# EAGLE design Tracker (EAGLE 8.3.1)
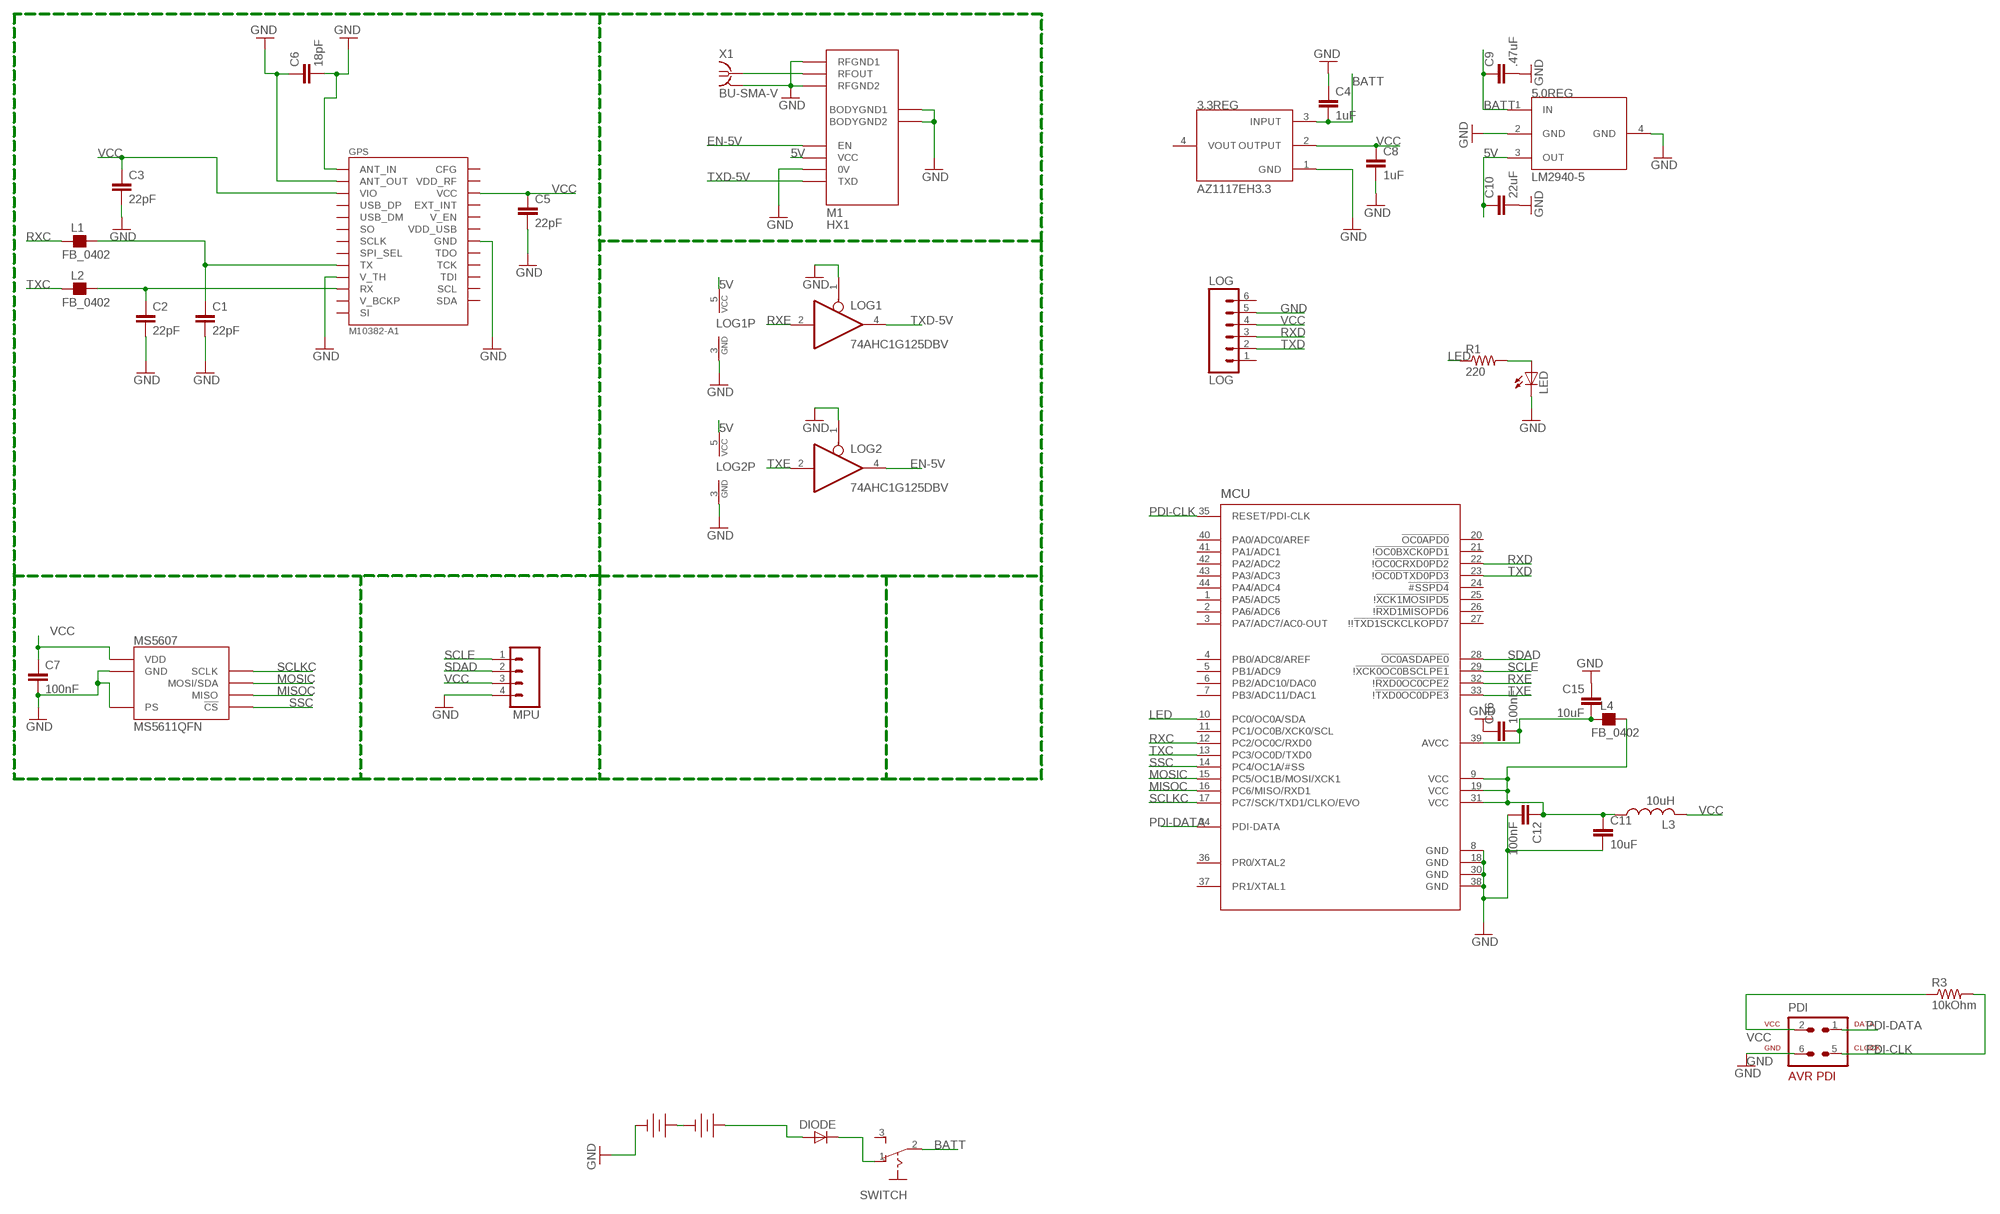
[diagram p0: schematic, sheet 1]

## Parts
3.3REG  AZ1117EH3.3  [SOT-223]
5.0REG  LM2940-5  [SOT-223]
BATT1  123_BATTERY_HOLDERCR-123-A  [CR-123-A_HOLDER]
BATT2  123_BATTERY_HOLDERCR-123-A  [CR-123-A_HOLDER]
C1  22pF  CAP0805  [0805]
C2  22pF  CAP0805  [0805]
C3  22pF  CAP0805  [0805]
C4  1uF  CAP0603-CAP  [0603-CAP]
C5  22pF  CAP0805  [0805]
C6  18pF  CAP0805  [0805]
C7  100nF  CAP0805  [0805]
C8  1uF  CAP0603-CAP  [0603-CAP]
C9  .47uF  CAP0603-CAP  [0603-CAP]
C10  22uF  CAP0603-CAP  [0603-CAP]
C11  10uF  CAP0805  [0805]
C12  100nF  CAP0805  [0805]
C15  10uF  CAP0805  [0805]
C16  100nF  CAP0805  [0805]
DIODE  LILYPAD-WEARABLES_LED1206  [LILYPAD-WEARABLES_LED-1206]
GPS  M10382-A1  [M10382-A1]
L1  FB_0402  [L0402]
L2  FB_0402  [L0402]
L3  10uH  L-USL2012C  [L2012C]
L4  FB_0402  [L0402]
LED  LEDCHIP-LED0603  [CHIP-LED0603]
LOG  LOG  SPARKFUN_M06SIP  [SPARKFUN_1X06]
LOG1  74AHC1G125DBV  [SOT23-5]
LOG2  74AHC1G125DBV  [SOT23-5]
M1  HX1  [HX1]
MCU  AT-XMEGA-XXA4-AU  [QFP80P1200X1200X120-44N]
MPU  M04  [04P]
MS5607  MS5611QFN  [MS5611-01BA01]
PDI  AVR-7_AVR-PDIVERT  [AVR-7_AVR-ISP-6]
R1  220  R-US_R0603  [R0603]
R3  10kOhm  RESISTOR0805-RES  [0805]
SWITCH  M251  [M251]
X1  BU-SMA-V  [BU-SMA-V]

## Nets
5V: 5.0REG.3(OUT) C10.1 LOG1.5(VCC) LOG2.5(VCC) M1.VCC
AVCC: C15.2 C16.2 L4.1 MCU.39(AVCC)
BATT: 3.3REG.3(INPUT) 5.0REG.1(IN) C4.2 C9.1 SWITCH.2(P)
EN-5V: LOG2.4(O) M1.EN
GND: 3.3REG.1(GND) 5.0REG.2(GND) 5.0REG.4(GND) BATT2.- C1.2 C2.2 C3.2 C4.1 C5.2 C6.1 C6.2 C7.2 C8.2 C9.2 C10.2 C11.2 C12.2 C15.1 C16.1 GPS.1(ANT_IN) GPS.2(GND) GPS.3(ANT_OUT) GPS.4(GND) GPS.12(V_TH) GPS.14(GND) GPS.17(GND) GPS.21(GND) GPS.24(GND) GPS.26(GND) GPS.28(GND) GPS.33(GND) GPS.34(GND) GPS.35(GND) GPS.36(GND) LED.C LOG1.1(OE) LOG1.3(GND) LOG2.1(OE) LOG2.3(GND) LOG.5 M1.0V M1.BODYGND1 M1.BODYGND2 M1.RFGND1 M1.RFGND2 MCU.8(GND) MCU.18(GND) MCU.30(GND) MCU.38(GND) MPU.4 MS5607.2(PS) MS5607.3(GND) PDI.6 X1.2(GND)
LED: MCU.10(PC0/OC0A/SDA) R1.1
MISOC: MCU.16(PC6/MISO/RXD1) MS5607.6(MISO)
MOSIC: MCU.15(PC5/OC1B/MOSI/XCK1) MS5607.7(MOSI/SDA)
N$1: C1.1 GPS.11(TX) L1.2
N$2: C2.1 GPS.13(RX) L2.2
N$4: BATT1.- BATT2.+
N$5: M1.RFOUT X1.1
N$6: BATT1.+ DIODE.A
N$7: DIODE.C SWITCH.1(O)
N$10: LED.A R1.2
N$18: C11.1 C12.1 L3.1 L4.2 MCU.9(VCC) MCU.19(VCC) MCU.31(VCC)
PDI-CLK: MCU.35(RESET/PDI-CLK) PDI.5 R3.2
PDI-DATA: MCU.34(PDI-DATA) PDI.1
RXC: L1.1 MCU.12(PC2/OC0C/RXD0)
RXD: LOG.3 MCU.22(!!OC0CRXD0PD2)
RXE: LOG1.2(I) MCU.32(!!RXD0OC0CPE2)
SCLE: MCU.29(!!XCK0OC0BSCLPE1) MPU.1
SCLKC: MCU.17(PC7/SCK/TXD1/CLKO/EVO) MS5607.8(SCLK)
SDAD: MCU.28(!OC0ASDAPE0) MPU.2
SSC: MCU.14(PC4/OC1A/#SS) MS5607.4(!CS!) MS5607.5(!CS!)
TXC: L2.1 MCU.13(PC3/OC0D/TXD0)
TXD: LOG.2 MCU.23(!!OC0DTXD0PD3)
TXD-5V: LOG1.4(O) M1.TXD
TXE: LOG2.2(I) MCU.33(!!TXD0OC0DPE3)
VCC: 3.3REG.2(OUTPUT) C3.1 C5.1 C7.1 C8.1 GPS.5(VIO) GPS.27(VCC) L3.2 LOG.4 MPU.3 MS5607.1(VDD) PDI.2 R3.1
Unconnected: 3.3REG.4(VOUT) GPS.6(USB_DP) GPS.7(USB_DM) GPS.8(SO) GPS.9(SCLK) GPS.10(SPI_SEL) GPS.15(V_BCKP) GPS.16(SI) GPS.18(SDA) GPS.19(SCL) GPS.20(TDI) GPS.22(TCK) GPS.23(TDO) GPS.25(VDD_RF) GPS.29(EXT_INT) GPS.30(V_EN) GPS.31(CFG) GPS.32(VDD_USB) LOG.1 LOG.6 MCU.1(PA5/ADC5) MCU.2(PA6/ADC6) MCU.3(PA7/ADC7/AC0-OUT) MCU.4(PB0/ADC8/AREF) MCU.5(PB1/ADC9) MCU.6(PB2/ADC10/DAC0) MCU.7(PB3/ADC11/DAC1) MCU.11(PC1/OC0B/XCK0/SCL) MCU.20(!OC0APD0) MCU.21(!!OC0BXCK0PD1) MCU.24(!#SSPD4) MCU.25(!!XCK1MOSIPD5) MCU.26(!!RXD1MISOPD6) MCU.27(!!!TXD1SCKCLKOPD7) MCU.36(PR0/XTAL2) MCU.37(PR1/XTAL1) MCU.40(PA0/ADC0/AREF) MCU.41(PA1/ADC1) MCU.42(PA2/ADC2) MCU.43(PA3/ADC3) MCU.44(PA4/ADC4) SWITCH.3(S)

## Power pins joined to a net without a drawn wire
GND: X1.3(GND) X1.4(GND) X1.5(GND)

## Library data of the parts
3.3REG = Physoon:AZ1117EH
5.0REG = Physoon:LM2940
BATT1 BATT2 = SHC:123_BATTERY_HOLDER
C1-C12 C15 C16 = SparkFun:CAP: Capacitor Standard 0603 ceramic capacitor, and 0.1" leaded capacitor.
DIODE = Physoon:LILYPAD-WEARABLES_LED: LEDs Standard schematic elements and footprints for 5mm, 3mm, 1206, and 0603 sized LEDs. 5mm - Spark Fun Electronics SKU : Comp-SBL
GPS = SHC:M10382-A1: Antenova’s GPS RADIONOVA® M10382 is a single package solution that combines a full GPS engine and antenna on a small SMD module. The M10382 is a highly integrated GPS RF Antenna Module suitable for L1-band GPS and A-GPS systems. The device combines the high performance u-blox 6 GPS position engine with Antenova’s high efficiency antenna technology in a small SMD module. M10382 also benefits from novel external matching that ensures easy tuning for each platform. All front-end and receiver components are contained in a single package laminate base module, providing a complete GPS receiver for optimum performance. The M10382 operates on 1.8V or 3.3V positive supply with low power consumption and several low power modes for further power savings. An accurate 0.5ppm TCXO and very low noise LNA ensures high sensitivity and short TTFF. The M10382 is supported by u-blox stand alone software and is compatible with UART, SPI, DDC, I2C and USB host processor interfaces.
L1 L2 L4 = rc-master-smd:FB_: FERRITE BEAD
L3 = rcl:L-US: INDUCTOR, American symbol
LED = led:LED: LED OSRAM: - CHIPLED LG R971, LG N971, LY N971, LG Q971, LY Q971, LO R971, LY R971 LH N974, LH R974 LS Q976, LO Q976, LY Q976 LO Q996 - Hyper CHIPLED LW Q18S LB Q993, LB Q99A, LB R99A - SideLED LS A670, LO A670, LY A670, LG A670, LP A670 LB A673, LV A673, LT A673, LW A673 LH A674 LY A675 LS A676, LA A676, LO A676, LY A676, LW A676 LS A679, LY A679, LG A679 - Hyper Micro SIDELED® LS Y876, LA Y876, LO Y876, LY Y876 LT Y87S - SmartLED LW L88C, LW L88S LB L89C, LB L89S, LG L890 LS L89K, LO L89K, LY L89K LS L896, LA L896, LO L896, LY L896 - TOPLED LS T670, LO T670, LY T670, LG T670, LP T670 LSG T670, LSP T670, LSY T670, LOP T670, LYG T670 LG T671, LOG T671, LSG T671 LB T673, LV T673, LT T673, LW T673 LH T674 LS T676, LA T676, LO T676, LY T676, LB T676, LH T676, LSB T676, LW T676 LB T67C, LV T67C, LT T67C, LS T67K, LO T67K, LY T67K, LW E67C LS E67B, LA E67B, LO E67B, LY E67B, LB E67C, LV E67C, LT E67C LW T67C LS T679, LY T679, LG T679 LS T770, LO T770, LY T770, LG T770, LP T770 LB T773, LV T773, LT T773, LW T773 LH T774 LS E675, LA E675, LY E675, LS T675 LS T776, LA T776, LO T776, LY T776, LB T776 LHGB T686 LT T68C, LB T68C - Hyper Mini TOPLED® LB M676 - Mini TOPLED Santana® LG M470 LS M47K, LO M47K, LY M47K Source: http://www.osram.convergy.de LUXEON: - LUMILED® LXK2-PW12-R00, LXK2-PW12-S00, LXK2-PW14-U00, LXK2-PW14-V00 LXK2-PM12-R00, LXK2-PM12-S00, LXK2-PM14-U00 LXK2-PE12-Q00, LXK2-PE12-R00, LXK2-PE12-S00, LXK2-PE14-T00, LXK2-PE14-U00 LXK2-PB12-K00, LXK2-PB12-L00, LXK2-PB12-M00, LXK2-PB14-N00, LXK2-PB14-P00, LXK2-PB14-Q00 LXK2-PR12-L00, LXK2-PR12-M00, LXK2-PR14-Q00, LXK2-PR14-R00 LXK2-PD12-Q00, LXK2-PD12-R00, LXK2-PD12-S00 LXK2-PH12-R00, LXK2-PH12-S00 LXK2-PL12-P00, LXK2-PL12-Q00, LXK2-PL12-R00 Source: www.luxeon.com KINGBRIGHT: KA-3528ASYC Source: www.kingbright.com
LOG = Tracker:SPARKFUN_M06: Header 6 Standard 6-pin 0.1" header. Use with straight break away headers (SKU : PRT-00116), right angle break away headers (PRT-00553), swiss pins (PRT-00743), machine pins (PRT-00117), and female headers (PRT-00115). Molex polarized connector foot print use with SKU : PRT-08094 with associated crimp pins and housings. NOTES ON THE VARIANTS LOCK and LOCK_LONGPADS... This footprint was designed to help hold the alignment of a through-hole component (i.e. 6-pin header) while soldering it into place. You may notice that each hole has been shifted either up or down by 0.005 of an inch from it's more standard position (which is a perfectly straight line). This slight alteration caused the pins (the squares in the middle) to touch the edges of the holes. Because they are alternating, it causes a "brace" to hold the component in place. 0.005 has proven to be the perfect amount of "off-center" position when using our standard breakaway headers. Although looks a little odd when you look at the bare footprint, once you have a header in there, the alteration is very hard to notice. Also, if you push a header all the way into place, it is covered up entirely on the bottom side. This idea of altering the position of holes to aid alignment will be further integrated into the Sparkfun Library for other footprints. It can help hold any component with 3 or more connection pins.
LOG1 LOG2 = 74xx-little-us:74*1G125: Single Bus Buffer Gate with 3-State Output
M1 = trackuino:HX1
MCU = xmega-a4:AT-XMEGA-XXA4-AU: ATxMega a4 Serie
MPU = con-amp-quick:M04: AMP QUICK CONNECTOR; OC_FARNELL: unknown; OC_NEWARK: unknown
MS5607 = SHC:MS5611
PDI = Tracker:AVR-7_AVR-PDI: AVR PDI programming interface connector
R1 = resistor:R-US_: RESISTOR, American symbol
R3 = SparkFun:RESISTOR: Resistor Basic schematic elements and footprints for 0603, 1206, and PTH resistors.
SWITCH = switch:M251: SLIDING SWITCH Mors, distributor Buerklin, 11G702
X1 = con-coax:BU-SMA-V: FEMALE SMA CONNECTOR Radiall distributor RS 112-3794; OC_FARNELL: unknown; OC_NEWARK: unknown

## Board
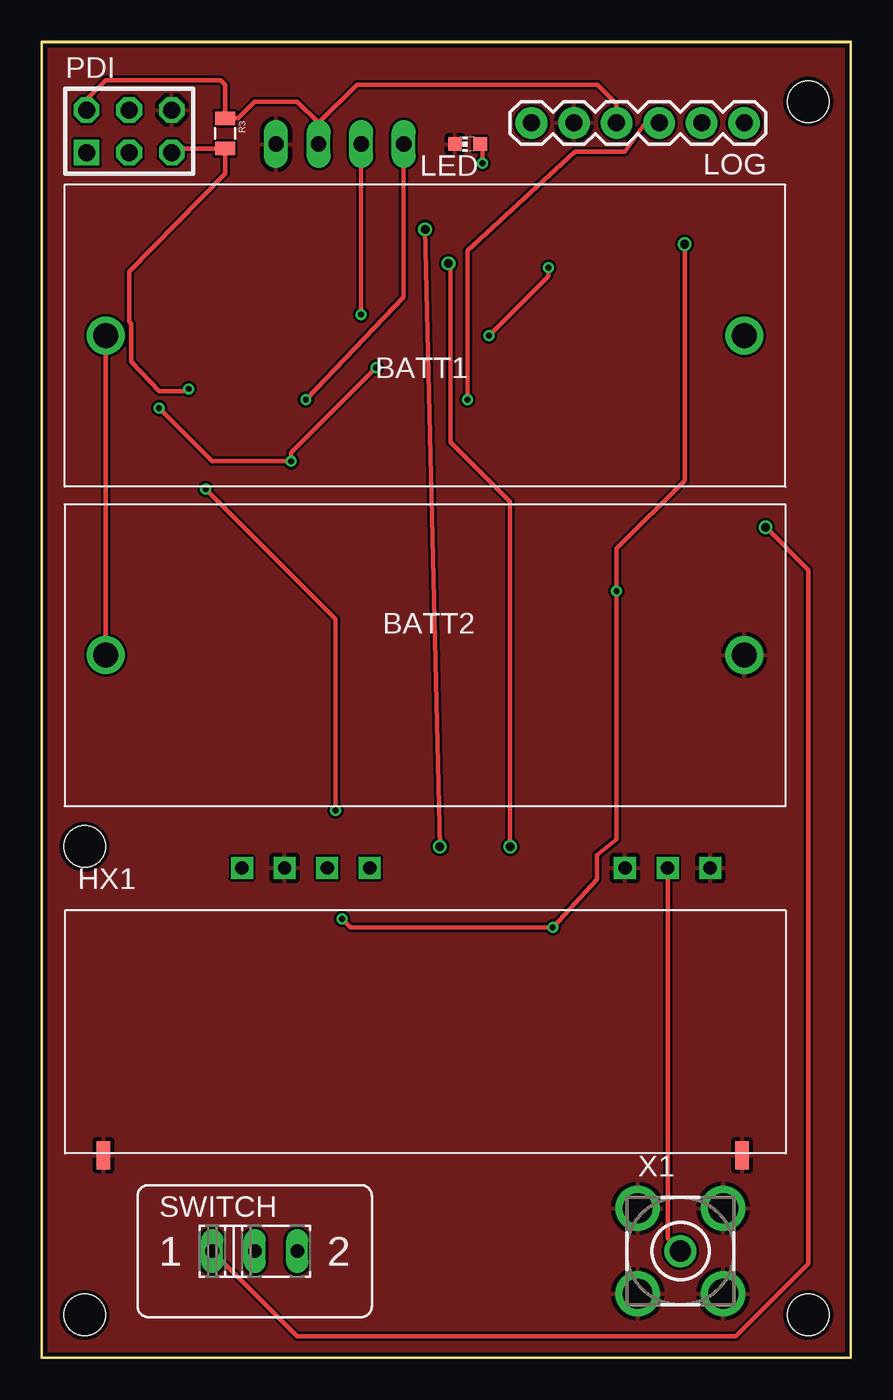
[diagram p1: board, top side]
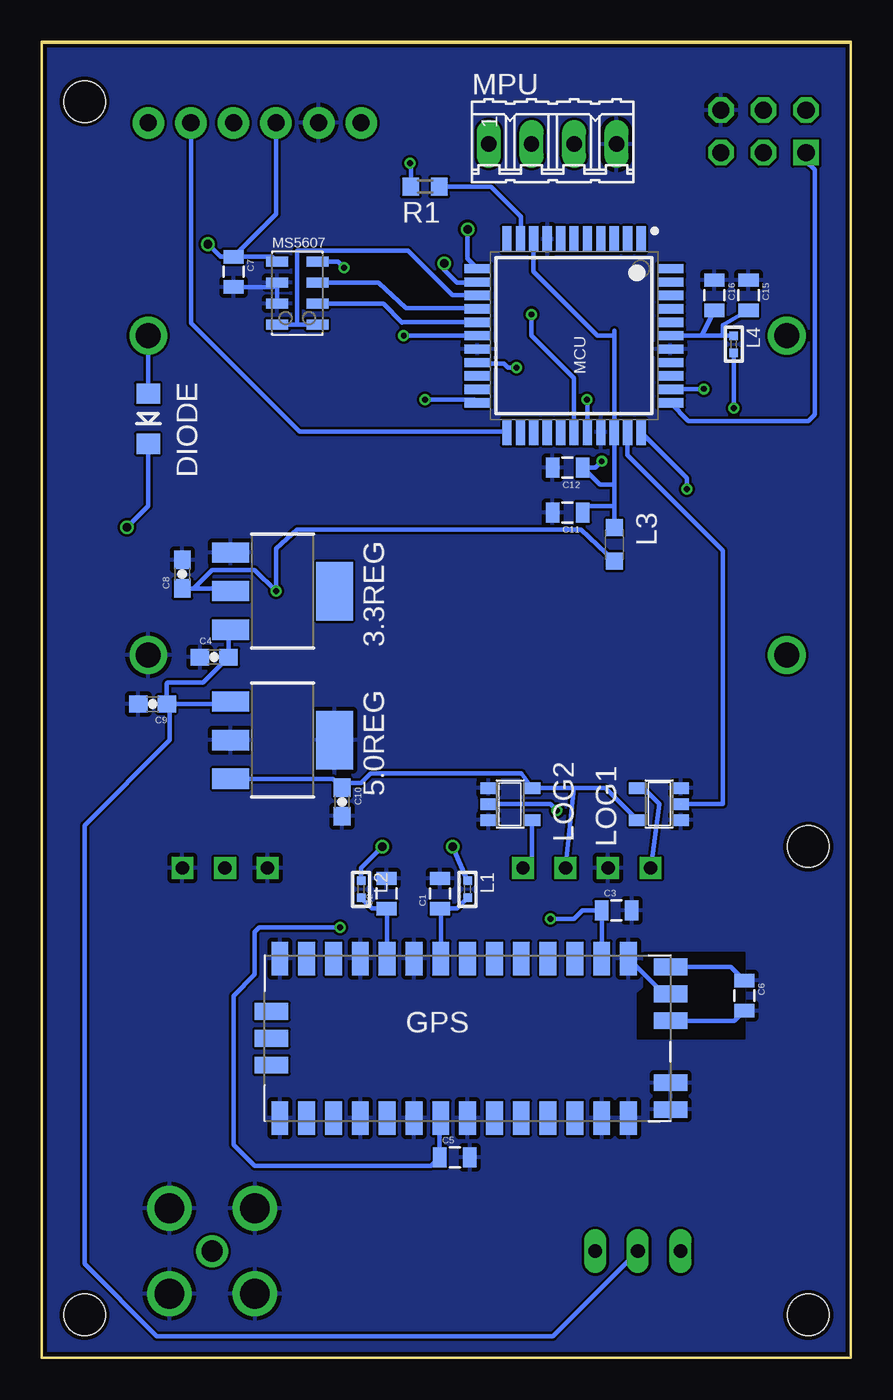
[diagram p2: board, bottom side, seen from below]

Size 48.26 x 78.49 mm. Coordinates in mm from the lower left corner, seen from the top.
Outline: 48.24,0 48.24,78.41 0,78.41 0,0
Outline: 0,0 48.24,0
Outline: 48.24,0 48.26,0 48.26,78.49 0,78.49 0,0
Copper layers (1*16): Top 0.035mm / dielectric 1.5mm / Bottom 0.035mm
Design rules "SeeedStudio_2layer_DRU_no_angle_20140221": minimum track width 6mil, minimum drill 12mil, track to track 6mil, track to pad 6mil, pad to pad 6mil, via to via 6mil, smd to smd 0mil, copper to edge 10mil, drill to drill 10mil, minimum pad ring 10mil, minimum via ring 6mil, stop-mask expansion 2mil, vias tented up to drill 100mil, thermal gap 10mil
Holes 2.46 mm at 2.54,2.54 2.54,30.48 45.72,74.93 45.72,2.54

### Footprints (pad centres in the part's own frame; a part is rotated, then mirrored left to right if it is on the bottom)
SOT-223 = smd 1.2 x 2.2: 1 -2.3,1.1; 2 0,1.1; 3 2.3,1.1 | smd 3.5 x 2.2: 4 0,7.3
CR-123-A_HOLDER = drill 1.5: + -19.05,0; - 19.05,0
0805 = smd 0.8 x 1.2: 1 -0.9,0; 2 0.9,0
0603-CAP = smd 1.1 x 1: 1 -0.85,0; 2 0.85,0
LILYPAD-WEARABLES_LED-1206 = smd 1.2 x 1.4: A -1.5,0; C 1.5,0
M10382-A1 = smd 1 x 2: 1 -1.05,12.1; 2 -2.65,12.1; 3 -4.25,12.1; 18 -1.6,-11.7; 19 0,-11.7; 20 1.6,-11.7; 35 4.25,12.1; 36 2.65,12.1 | smd 2 x 1: 4 -4.75,9.6; 5 -4.75,8; 6 -4.75,6.4; 7 -4.75,4.8; 8 -4.75,3.2; 9 -4.75,1.6; 10 -4.75,0; 11 -4.75,-1.6; 12 -4.75,-3.2; 13 -4.75,-4.8; 14 -4.75,-6.4; 15 -4.75,-8; 16 -4.75,-9.6; 17 -4.75,-11.2; 21 4.75,-11.2; 22 4.75,-9.6; 23 4.75,-8; 24 4.75,-6.4; 25 4.75,-4.8; 26 4.75,-3.2; 27 4.75,-1.6; 28 4.75,0; 29 4.75,1.6; 30 4.75,3.2; 31 4.75,4.8; 32 4.75,6.4; 33 4.75,8; 34 4.75,9.6
L0402 = smd 0.5 x 0.5: 1 -0.508,0; 2 0.508,0
L2012C = smd 1 x 1: 1 -1,0; 2 1,0
CHIP-LED0603 = smd 0.8 x 0.8: A 0,-0.75; C 0,0.75
SPARKFUN_1X06 = drill 1.016 pad 1.88: 1 0,0; 2 2.54,0; 3 5.08,0; 4 7.62,0; 5 10.16,0; 6 12.7,0
SOT23-5 = smd 0.69 x 0.99: 1 -0.95,-1.29; 2 0,-1.29; 3 0.95,-1.29; 4 0.95,1.3; 5 -0.95,1.3
HX1 = drill 0.8 square: 0V 25.4,-8.89; EN 20.32,-8.89; RFGND1 0,-8.89; RFGND2 5.08,-8.89; RFOUT 2.54,-8.89; TXD 27.94,-8.89; VCC 22.86,-8.89 | smd 0.813 x 1.676: BODYGND1 -1.905,8.255; BODYGND2 36.195,8.255
QFP80P1200X1200X120-44N = smd 1.55 x 0.55: 1 -5.75,4; 2 -5.75,3.2; 3 -5.75,2.4; 4 -5.75,1.6; 5 -5.75,0.8; 6 -5.75,0; 7 -5.75,-0.8; 8 -5.75,-1.6; 9 -5.75,-2.4; 10 -5.75,-3.2; 11 -5.75,-4; 23 5.75,-4; 24 5.75,-3.2; 25 5.75,-2.4; 26 5.75,-1.6; 27 5.75,-0.8; 28 5.75,0; 29 5.75,0.8; 30 5.75,1.6; 31 5.75,2.4; 32 5.75,3.2; 33 5.75,4 | smd 0.55 x 1.55: 12 -4,-5.75; 13 -3.2,-5.75; 14 -2.4,-5.75; 15 -1.6,-5.75; 16 -0.8,-5.75; 17 0,-5.75; 18 0.8,-5.75; 19 1.6,-5.75; 20 2.4,-5.75; 21 3.2,-5.75; 22 4,-5.75; 34 4,5.75; 35 3.2,5.75; 36 2.4,5.75; 37 1.6,5.75; 38 0.8,5.75; 39 0,5.75; 40 -0.8,5.75; 41 -1.6,5.75; 42 -2.4,5.75; 43 -3.2,5.75; 44 -4,5.75
04P = drill 0.914 long: 1 -3.81,0; 2 -1.27,0; 3 1.27,0; 4 3.81,0
MS5611-01BA01 = smd 1.3 x 0.6: 1 -1.2,1.875; 2 -1.2,0.625; 3 -1.2,-0.625; 4 -1.2,-1.875; 5 1.2,-1.875; 6 1.2,-0.625; 7 1.2,0.625; 8 1.2,1.875
AVR-7_AVR-ISP-6 = drill 1.016 square: 1 -2.54,-1.27 | drill 1.016 octagon: 2 -2.54,1.27; 3 0,-1.27; 4 0,1.27; 5 2.54,-1.27; 6 2.54,1.27
R0603 = smd 1 x 1.1: 1 -0.85,0; 2 0.85,0
M251 = drill 0.813 long: 1 -2.54,0; 2 0,0; 3 2.54,0
BU-SMA-V = drill 1.27: 1 0,0 | drill 1.778: 2 -2.55,2.55; 3 2.55,2.55; 4 2.55,-2.55; 5 -2.55,-2.55

### Placement (x,y rotation side)
3.3REG  38.1,45.72 270 bottom
5.0REG  38.1,36.83 270 bottom
BATT1  22.86,60.96 180 top
BATT2  22.86,41.91 0 top
C1  24.51,27.69 90 bottom
C2  27.69,27.69 90 bottom
C3  13.97,26.67 0 bottom
C4  37.97,41.78 0 bottom
C5  23.62,11.94 0 bottom
C6  6.35,21.59 270 bottom
C7  36.83,64.77 270 bottom
C8  39.88,46.74 90 bottom
C9  41.66,38.99 180 bottom
C10  30.35,33.15 270 bottom
C11  16.89,50.42 180 bottom
C12  16.89,53.09 180 bottom
C15  6.1,63.37 270 bottom
C16  8.13,63.37 270 bottom
DIODE  41.91,56.01 270 bottom
GPS  22.86,19.05 270 bottom
L1  22.86,27.94 270 bottom
L2  29.21,27.94 270 bottom
L3  14.1,48.51 270 bottom
L4  6.99,60.45 270 bottom
LED  25.4,72.39 90 top
LOG  41.91,73.66 180 top
LOG1  11.43,33.02 90 bottom
LOG2  20.32,33.02 270 bottom
M1  39.88,20.32 180 top
MCU  16.51,60.96 270 bottom
MPU  17.78,72.39 0 bottom
MS5607  33.02,63.5 0 bottom
PDI  5.21,73.15 0 top
R1  25.4,69.85 180 bottom
R3  10.92,73.03 270 top
SWITCH  12.7,6.35 0 top
X1  38.1,6.35 0 top

### Tracks (layer width: path | path; a pad name or v marks a point on that pad's centre or on a via)
5V
  Bottom 0.254: 16.51,33.97 LOG2.5 19.64,34.85 21.59,34.85 22.22,34.85 28.65,34.85 29.21,34.29 30.06,34.29 C10.1 30.89,34.53 5.0REG.3 | 16.51,33.97 14.63,33.97 LOG1.5 | 16.51,33.97 M1.VCC
AVCC
  Bottom 0.254: L4.1 7.62,60.96 | 7.62,60.96 8.89,60.96 | 8.89,60.96 MCU.39 | 8.89,60.96 C16.2 | 7.62,60.96 7.62,61.59 C15.2
BATT
  Bottom 0.254: C4.2 37,41.66 | C4.2 37.12,43.3 3.3REG.3 | C4.2 38.65,40.26 40.77,40.26 40.81,40.22 C9.1 | C9.1 40.64,38.82 40.64,36.83 45.72,31.75 45.72,5.59 41.4,1.27 17.78,1.27 SWITCH.2 | C9.1 37.14,38.99 5.0REG.1
EN-5V
  Bottom 0.254: LOG2.4 19.02,29.24 M1.EN
GND
  Bottom 0.254: C7.2 34.48,63.87 MS5607.2 MS5607.3 | GPS.3 7.16,23.3 C6.1 | GPS.1 6.94,20.1 C6.2 | GPS.2 11.16,21.7 GPS.4
  pour Bottom: 0,0 48.26,0 48.26,78.36 0,78.36
  pour Top: 0,0 48.26,0 48.26,78.36 0,78.36
LED
  Bottom 0.254: R1.1 22.86,69.85 | 22.86,69.85 22.2,69.85 | 22.86,69.85 21.46,69.85 19.68,68.07 19.68,66.73 MCU.10
MISOC
  Bottom 0.254: MS5607.6 27.89,62.88 26.77,61.75 26.76,61.76 MCU.16
MOSIC
  Bottom 0.254: MS5607.7 28.18,64.12 26.54,62.61 22.31,62.61 MCU.15
N$1
  Bottom 0.254: GPS.11 24.46,26.73 C1.1 23.51,26.79 L1.2
N$2
  Bottom 0.254: GPS.13 27.66,26.76 C2.1 28.56,26.79 L2.2
N$4
  Top 0.254: BATT2.+ BATT1.-
N$5
  Top 0.254: M1.RFOUT 37.34,7.11 X1.1
N$6
  Bottom 0.254: BATT1.+ DIODE.A
N$7  (via drill 0.51)
  Top 0.254: v43.18,49.53 45.72,46.99 45.72,5.59 41.4,1.27 15.24,1.27 SWITCH.1
  Bottom 0.254: DIODE.C 41.91,50.8 v43.18,49.53
N$8
  cutout Bottom: 6.35,24.13 6.35,19.05 12.7,19.05 12.7,21.72 12.32,22.1 12.32,24.13
N$10  (via drill 0.35)
  Top 0.254: v26.29,71.25 26.29,72.25 LED.A
  Bottom 0.254: R1.2 26.25,71.21 v26.29,71.25
N$18  (via drill 0.35)
  Top 0.254: v6.99,56.64 10.16,53.47 v14.86,53.47 14.86,53.97 v19.94,59.06
  Bottom 0.254: L3.1 14.1,50.8 | 14.1,50.8 14.1,52.07 | 14.1,52.07 14.1,55.2 MCU.31 14.11,60.96 | 14.1,50.8 15.61,50.8 C11.1 | 14.1,52.07 14.97,52.07 C12.1 15.24,53.09 v14.86,53.47 | v6.99,56.64 L4.2 | 14.11,60.96 14.11,61.27 | v19.94,59.06 20.45,59.06 20.7,59.31 22.21,59.31 MCU.19 | 14.11,60.96 15.11,60.96 18.92,64.77 18.92,66.7 MCU.9
PDI-CLK  (via drill 0.35)
  Top 0.254: PDI.5 7.99,72.12 R3.2 10.92,70.61 5.21,64.77 5.21,61.8 5.34,61.67 5.34,59.43 6.99,57.66 8.64,57.66 v8.76,57.78
  Bottom 0.254: v8.76,57.78 10.73,57.78 MCU.35
PDI-DATA
  Bottom 0.254: MCU.34 9.68,55.88 2.54,55.88 2.16,56.26 2.16,70.87 2.67,71.37 PDI.1
RXC  (via drill 0.51)
  Top 0.254: v23.75,30.48 v22.86,67.31
  Bottom 0.254: L1.1 v23.75,30.48 | v22.86,67.31 22.86,65.56 MCU.12
RXD  (via drill 0.35)
  Top 0.254: LOG.3 36.01,73.66 34.8,71.93 31.8,71.93 25.4,66.04 v25.4,57.15
  Bottom 0.254: v25.4,57.15 22.45,57.15 MCU.22
RXE
  Bottom 0.254: LOG1.2 7.62,33.02 7.62,48.13 13.34,53.85 13.34,55.19 MCU.32
SCLE  (via drill 0.35)
  Top 0.254: MPU.1 21.59,63.25 v15.75,57.15
  Bottom 0.254: MCU.29 15.71,57.11 v15.75,57.15
SCLKC  (via drill 0.35)
  Top 0.254: v30.23,65.02 30.23,64.52 v26.67,60.96
  Bottom 0.254: MS5607.8 30.58,65.38 v30.23,65.02 | v26.67,60.96 MCU.17
SDAD  (via drill 0.35)
  Top 0.254: MPU.2 v19.05,62.23
  Bottom 0.254: v19.05,62.23 19.05,60.96 16.51,58.42 MCU.28
SSC
  Bottom 0.254: MS5607.4 33.02,61.62 | 33.02,61.62 MS5607.5 | 33.02,61.62 33.02,66.04 26.42,66.04 23.75,63.37 22.27,63.37 MCU.14
TXC  (via drill 0.51)
  Top 0.254: v27.94,30.48 27.94,51.05 24.38,54.61 24.38,65.15 v24.26,65.28
  Bottom 0.254: L2.1 29.21,29.21 v27.94,30.48 | v24.26,65.28 24.26,64.9 23.5,64.14 22.29,64.14 MCU.13
TXD
  Bottom 0.254: LOG.2 39.37,61.72 32.89,55.25 20.55,55.25 MCU.23
TXD-5V
  Bottom 0.254: LOG1.4 12.38,33.97 11.43,33.02 M1.TXD
TXE  (via drill 0.35)
  Top 0.254: v17.53,32.64 17.53,44.07 v9.78,51.82
  Bottom 0.254: LOG2.2 17.91,33.02 v17.53,32.64 | v9.78,51.82 9.78,52.48 MCU.33
VCC  (via drill 0.35, 0.51)
  Top 0.254: v17.91,26.16 18.41,25.65 v30.48,25.65 33.1,28.53 33.1,29.98 34.29,30.91 v34.29,45.72 34.29,48.26 38.35,52.32 v38.35,66.42 | PDI.2 2.67,75.06 3.81,76.2 10.67,76.2 10.92,75.95 R3.1 11.7,73.92 12.7,74.93 15.24,74.93 16.51,73.66 | 16.51,73.66 MPU.3 | LOG.4 34.29,74.8 33.15,75.95 18.8,75.95 16.51,73.66
  Bottom 0.254: C7.1 34.52,65.67 MS5607.1 | LOG.4 34.29,68.21 C7.1 | GPS.5 C3.1 16,26.67 16.51,26.16 v17.91,26.16 | GPS.27 24.52,14.24 C5.1 25.03,11.43 35.56,11.43 36.83,12.7 36.83,21.59 35.56,22.86 35.56,25.4 35.31,25.65 v30.48,25.65 | 3.3REG.2 37.17,45.89 C8.1 39.2,45.89 38.1,46.99 35.56,46.99 v34.29,45.72 34.29,48.26 33.02,49.4 16.11,49.4 L3.2 | C7.1 37.6,65.67 v38.35,66.42